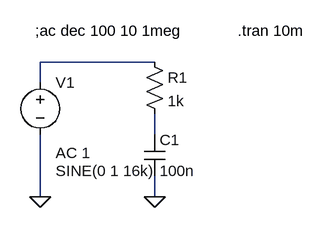
[diagram p0: schematic Draft2.asc]
Draft2.asc, the LTspice schematic file:
Version 4
SHEET 1 880 680
WIRE 272 80 96 80
WIRE 96 112 96 80
WIRE 272 192 272 160
WIRE 96 288 96 192
WIRE 272 288 272 256
FLAG 96 288 0
FLAG 272 288 0
SYMBOL voltage 96 96 R0
WINDOW 3 24 152 Left 2
WINDOW 123 24 124 Left 2
WINDOW 39 0 0 Left 0
SYMATTR InstName V1
SYMATTR Value SINE(0 1 16k)
SYMATTR Value2 AC 1
SYMBOL res 256 64 R0
SYMATTR InstName R1
SYMATTR Value 1k
SYMBOL cap 256 192 R0
SYMATTR InstName C1
SYMATTR Value 100n
TEXT 88 32 Left 2 !;ac dec 100 10 1meg
TEXT 400 32 Left 2 !.tran 10m

The netlist it stands for:
* Draft2.asc
V1 N001 0 SINE(0 1 16k) AC 1
R1 N001 N002 1k
C1 N002 0 100n
;ac dec 100 10 1meg
.tran 10m
.backanno
.end